# EAGLE schematic tinynumitronboard (EAGLE 6.3)
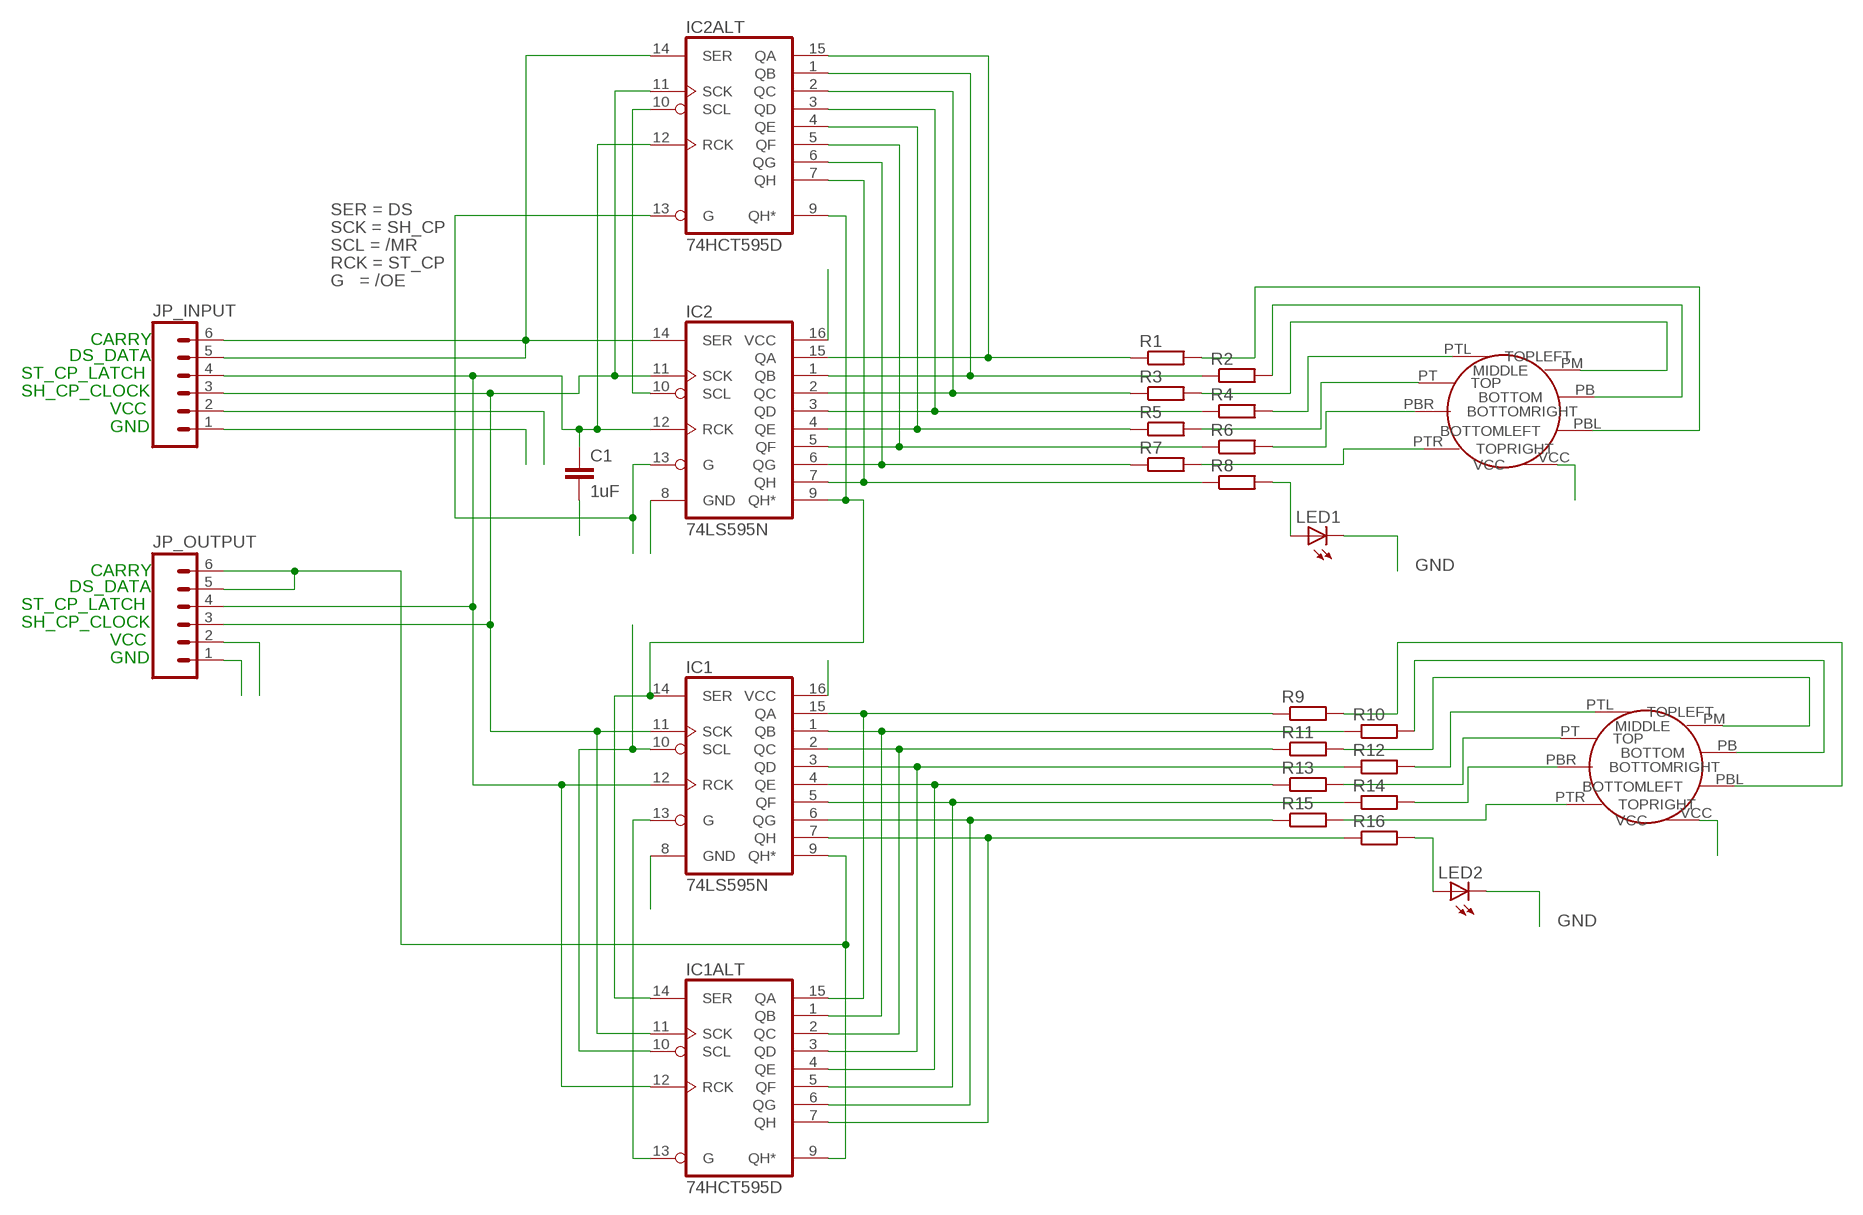
[diagram p0: schematic, sheet 1]

## Parts
C1  1uF  C-EU050-024X044  [C050-024X044]
IC1  74LS595N  [DIL16]
IC1ALT  74HCT595D  [SO16]
IC2  74LS595N  [DIL16]
IC2ALT  74HCT595D  [SO16]
JP_INPUT  M06SIP  [1X06]
JP_OUTPUT  M06SIP  [1X06]
LED1  LEDKA-3528ASYC  [KA-3528ASYC]
LED2  LEDKA-3528ASYC  [KA-3528ASYC]
R1  R-EU_0207/10  [0207/10]
R2  R-EU_0207/10  [0207/10]
R3  R-EU_0207/10  [0207/10]
R4  R-EU_0207/10  [0207/10]
R5  R-EU_0207/10  [0207/10]
R6  R-EU_0207/10  [0207/10]
R7  R-EU_0207/10  [0207/10]
R8  R-EU_0207/10  [0207/10]
R9  R-EU_0207/10  [0207/10]
R10  R-EU_0207/10  [0207/10]
R11  R-EU_0207/10  [0207/10]
R12  R-EU_0207/10  [0207/10]
R13  R-EU_0207/10  [0207/10]
R14  R-EU_0207/10  [0207/10]
R15  R-EU_0207/10  [0207/10]
R16  R-EU_0207/10  [0207/10]
U$1  IV16TINY_NUMITRON  [IV16TINY_NUMITRON_PAC]
U$2  IV16TINY_NUMITRON  [IV16TINY_NUMITRON_PAC]

## Nets
GND: C1.2 IC1.8(GND) IC1.13(G) IC1ALT.13(G) IC2.8(GND) IC2.13(G) IC2ALT.13(G) JP_INPUT.1 JP_OUTPUT.1 LED1.C LED2.C
N$1: R1.2 U$1.PBL(BOTTOMLEFT)
N$2: R2.2 U$1.PB(BOTTOM)
N$3: R3.2 U$1.PM(MIDDLE)
N$4: R4.2 U$1.PTL(TOPLEFT)
N$5: R5.2 U$1.PT(TOP)
N$6: R6.2 U$1.PBR(BOTTOMRIGHT)
N$7: R7.2 U$1.PTR(TOPRIGHT)
N$8: IC1.1(QB) IC1ALT.1(QB) R10.1
N$9: IC1.2(QC) IC1ALT.2(QC) R11.1
N$10: IC1.3(QD) IC1ALT.3(QD) R12.1
N$11: IC1.4(QE) IC1ALT.4(QE) R13.1
N$12: IC2.4(QE) IC2ALT.4(QE) R5.1
N$13: IC2.3(QD) IC2ALT.3(QD) R4.1
N$14: IC1.5(QF) IC1ALT.5(QF) R14.1
N$15: IC1.6(QG) IC1ALT.6(QG) R15.1
N$16: IC2.7(QH) IC2ALT.7(QH) R8.1
N$17: LED1.A R8.2
N$19: IC2.2(QC) IC2ALT.2(QC) R3.1
N$20: R9.2 U$2.PBL(BOTTOMLEFT)
N$21: R10.2 U$2.PB(BOTTOM)
N$22: IC1.7(QH) IC1ALT.7(QH) R16.1
N$23: IC1.14(SER) IC1ALT.14(SER) IC2.9(QH*) IC2ALT.9(QH*)
N$24: R11.2 U$2.PM(MIDDLE)
N$25: R12.2 U$2.PTL(TOPLEFT)
N$26: R13.2 U$2.PT(TOP)
N$27: R14.2 U$2.PBR(BOTTOMRIGHT)
N$28: R15.2 U$2.PTR(TOPRIGHT)
N$37: LED2.A R16.2
N$38: IC2.14(SER) IC2ALT.14(SER) JP_INPUT.5 JP_INPUT.6
N$39: IC2.1(QB) IC2ALT.1(QB) R2.1
N$41: IC2.15(QA) IC2ALT.15(QA) R1.1
N$42: IC2.6(QG) IC2ALT.6(QG) R7.1
N$43: IC2.5(QF) IC2ALT.5(QF) R6.1
N$48: C1.1 IC1.12(RCK) IC1ALT.12(RCK) IC2.12(RCK) IC2ALT.12(RCK) JP_INPUT.4 JP_OUTPUT.4
N$52: IC1.15(QA) IC1ALT.15(QA) R9.1
N$54: IC1.11(SCK) IC1ALT.11(SCK) IC2.11(SCK) IC2ALT.11(SCK) JP_INPUT.3 JP_OUTPUT.3
N$56: IC1.9(QH*) IC1ALT.9(QH*) JP_OUTPUT.5 JP_OUTPUT.6
VCC: IC1.10(SCL) IC1.16(VCC) IC1ALT.10(SCL) IC2.10(SCL) IC2.16(VCC) IC2ALT.10(SCL) JP_INPUT.2 JP_OUTPUT.2 U$1.VCC U$2.VCC

## Notes on the sheet
- SER = DS
- SCK = SH_CP
- SCL = /MR
- RCK = ST_CP
- G   = /OE
- CARRY
- DS_DATA
- ST_CP_LATCH
- SH_CP_CLOCK
- VCC
- GND
- CARRY
- DS_DATA
- ST_CP_LATCH
- SH_CP_CLOCK
- VCC
- GND

## Power pins joined to a net without a drawn wire
GND: IC1ALT.8(GND) IC2ALT.8(GND)
VCC: IC1ALT.16(VCC) IC2ALT.16(VCC)

## Library data of the parts
C1 = resistor:C-EU: CAPACITOR, European symbol
IC1 IC2 = SparkFun:74*595: 8-bit SHIFT REGISTER, output latch
IC1ALT IC2ALT = 74xx-eu:74*595: 8-bit SHIFT REGISTER, output latch
JP_INPUT JP_OUTPUT = SparkFun:M06: Header 6 Standard 6-pin 0.1" header. Use with straight break away headers (SKU : PRT-00116), right angle break away headers (PRT-00553), swiss pins (PRT-00743), machine pins (PRT-00117), and female headers (PRT-00115). Molex polarized connector foot print use with SKU : PRT-08094 with associated crimp pins and housings. NOTES ON THE VARIANTS LOCK and LOCK_LONGPADS... This footprint was designed to help hold the alignment of a through-hole component (i.e. 6-pin header) while soldering it into place. You may notice that each hole has been shifted either up or down by 0.005 of an inch from it's more standard position (which is a perfectly straight line). This slight alteration caused the pins (the squares in the middle) to touch the edges of the holes. Because they are alternating, it causes a "brace" to hold the component in place. 0.005 has proven to be the perfect amount of "off-center" position when using our standard breakaway headers. Although looks a little odd when you look at the bare footprint, once you have a header in there, the alteration is very hard to notice. Also, if you push a header all the way into place, it is covered up entirely on the bottom side. This idea of altering the position of holes to aid alignment will be further integrated into the Sparkfun Library for other footprints. It can help hold any component with 3 or more connection pins.
LED1 LED2 = led:LED: LED OSRAM: - CHIPLED LG R971, LG N971, LY N971, LG Q971, LY Q971, LO R971, LY R971 LH N974, LH R974 LS Q976, LO Q976, LY Q976 LO Q996 - Hyper CHIPLED LW Q18S LB Q993, LB Q99A, LB R99A - SideLED LS A670, LO A670, LY A670, LG A670, LP A670 LB A673, LV A673, LT A673, LW A673 LH A674 LY A675 LS A676, LA A676, LO A676, LY A676, LW A676 LS A679, LY A679, LG A679 - Hyper Micro SIDELED® LS Y876, LA Y876, LO Y876, LY Y876 LT Y87S - SmartLED LW L88C, LW L88S LB L89C, LB L89S, LG L890 LS L89K, LO L89K, LY L89K LS L896, LA L896, LO L896, LY L896 - TOPLED LS T670, LO T670, LY T670, LG T670, LP T670 LSG T670, LSP T670, LSY T670, LOP T670, LYG T670 LG T671, LOG T671, LSG T671 LB T673, LV T673, LT T673, LW T673 LH T674 LS T676, LA T676, LO T676, LY T676, LB T676, LH T676, LSB T676, LW T676 LB T67C, LV T67C, LT T67C, LS T67K, LO T67K, LY T67K, LW E67C LS E67B, LA E67B, LO E67B, LY E67B, LB E67C, LV E67C, LT E67C LW T67C LS T679, LY T679, LG T679 LS T770, LO T770, LY T770, LG T770, LP T770 LB T773, LV T773, LT T773, LW T773 LH T774 LS E675, LA E675, LY E675, LS T675 LS T776, LA T776, LO T776, LY T776, LB T776 LHGB T686 LT T68C, LB T68C - Hyper Mini TOPLED® LB M676 - Mini TOPLED Santana® LG M470 LS M47K, LO M47K, LY M47K Source: http://www.osram.convergy.de LUXEON: - LUMILED® LXK2-PW12-R00, LXK2-PW12-S00, LXK2-PW14-U00, LXK2-PW14-V00 LXK2-PM12-R00, LXK2-PM12-S00, LXK2-PM14-U00 LXK2-PE12-Q00, LXK2-PE12-R00, LXK2-PE12-S00, LXK2-PE14-T00, LXK2-PE14-U00 LXK2-PB12-K00, LXK2-PB12-L00, LXK2-PB12-M00, LXK2-PB14-N00, LXK2-PB14-P00, LXK2-PB14-Q00 LXK2-PR12-L00, LXK2-PR12-M00, LXK2-PR14-Q00, LXK2-PR14-R00 LXK2-PD12-Q00, LXK2-PD12-R00, LXK2-PD12-S00 LXK2-PH12-R00, LXK2-PH12-S00 LXK2-PL12-P00, LXK2-PL12-Q00, LXK2-PL12-R00 Source: www.luxeon.com KINGBRIGHT: KA-3528ASYC Source: www.kingbright.com
R1-R16 = resistor:R-EU_: RESISTOR, European symbol
U$1 U$2 = kalshagar:IV16TINY_NUMITRON